# EAGLE design Buck300W_V3 (EAGLE 9.6.2)

## Sheet 1 of 2
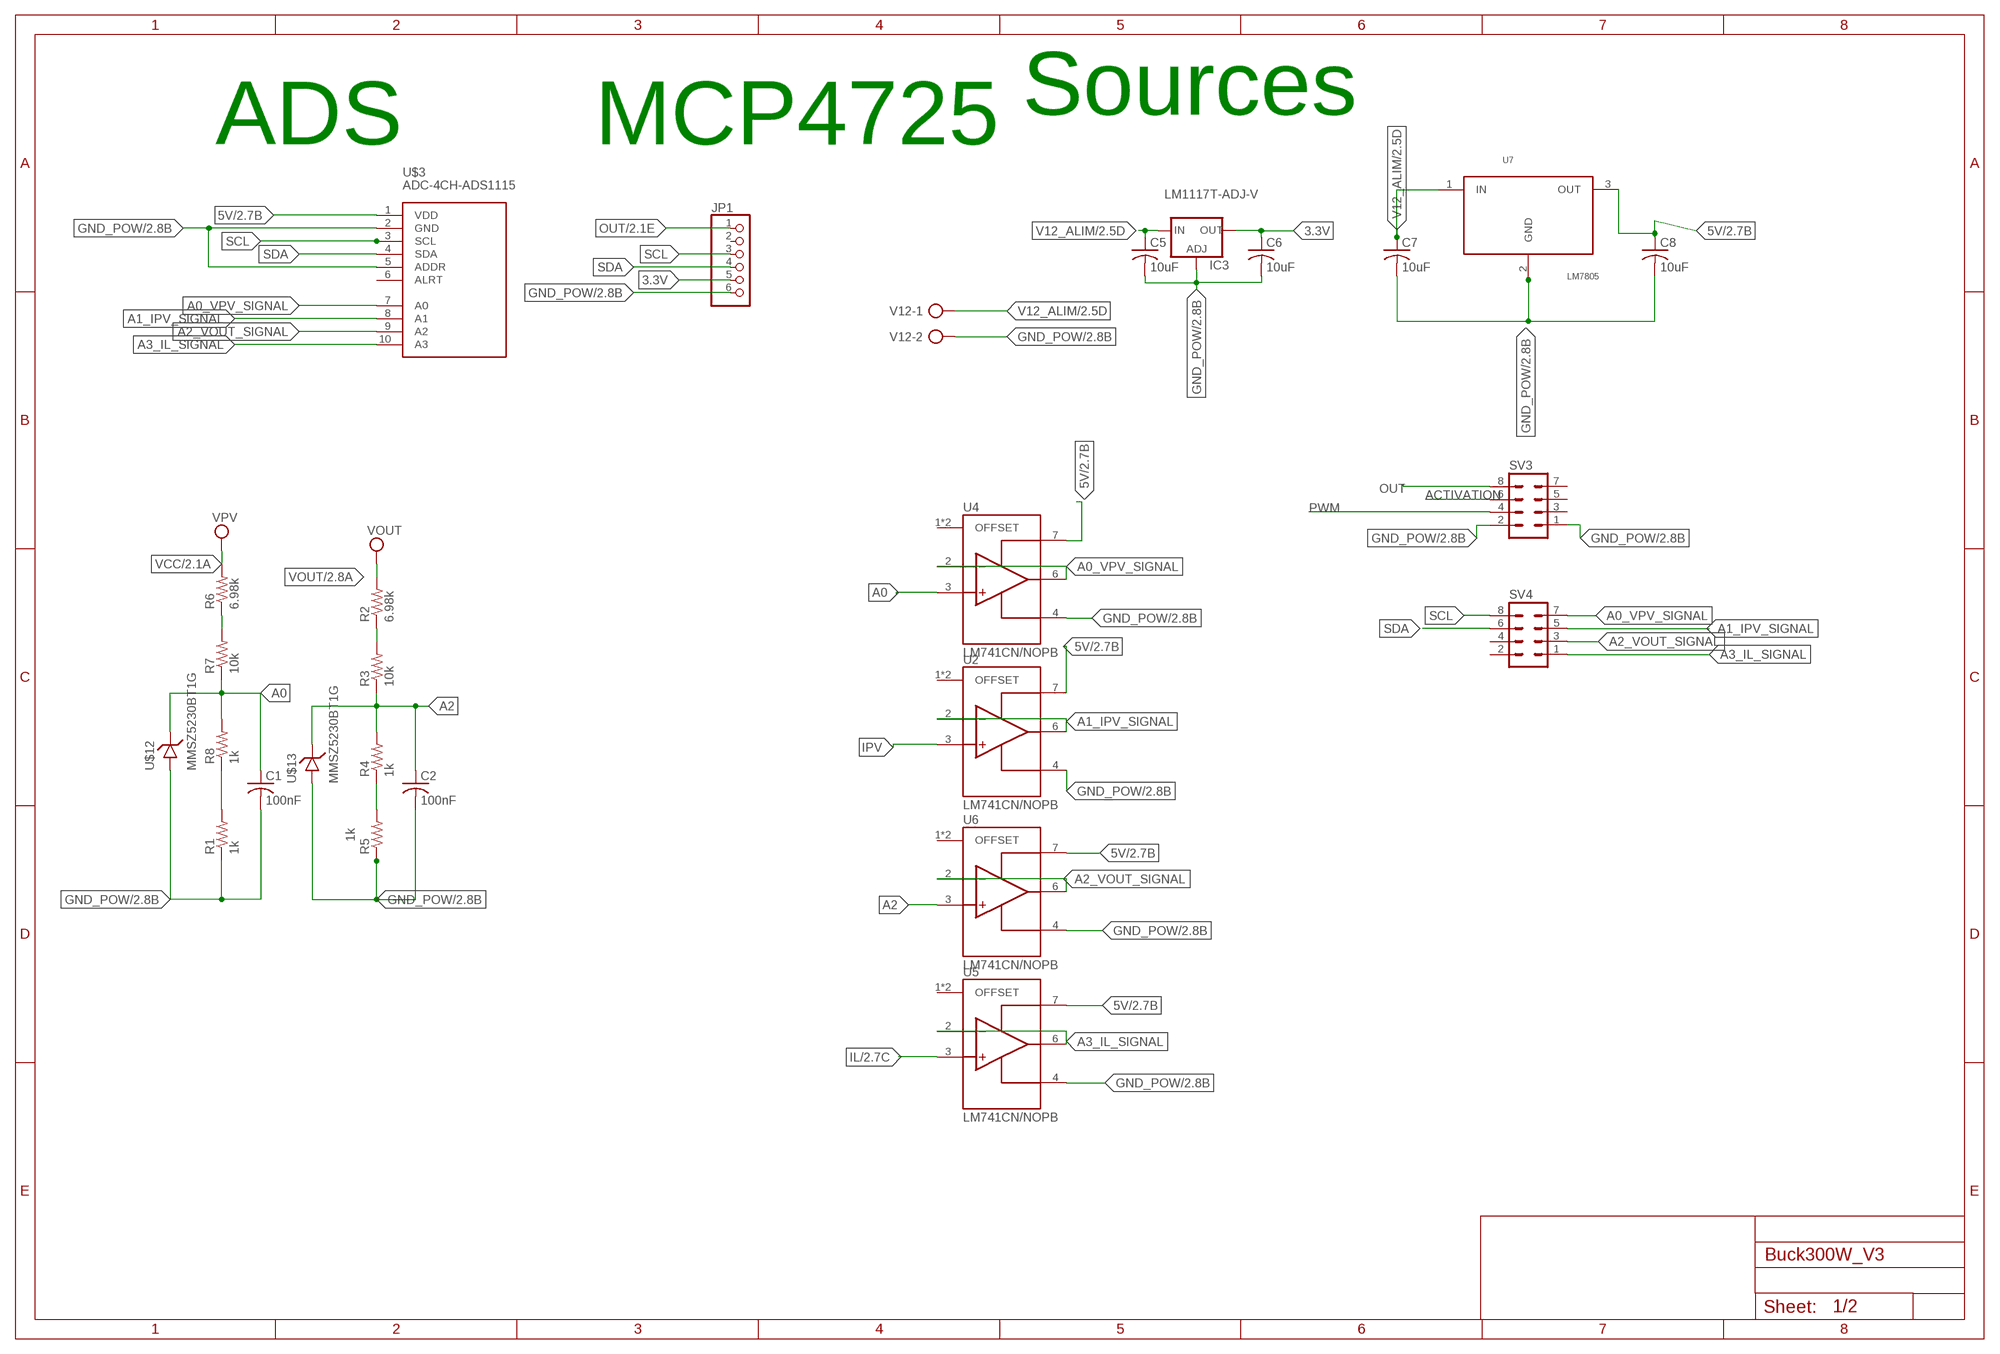
[diagram p0: schematic, sheet 1]

### Parts
C1  100nF  C-USC0805  [C0805]
C2  100nF  C-USC0805  [C0805]
C5  10uF  C-US025-024X044  [C025-024X044]
C6  10uF  C-US025-024X044  [C025-024X044]
C7  10uF  C-US025-024X044  [C025-024X044]
C8  10uF  C-US025-024X044  [C025-024X044]
IC3  LM1117T-ADJ-V  [TO220V]
JP1  MICROBUILDER_HEADER-1X6  [MICROBUILDER_1X06_OVAL]
R1  1k  R-US_R0805  [R0805]
R2  6.98k  R-US_R0805  [R0805]
R3  10k  R-US_R0805  [R0805]
R4  1k  R-US_R0805  [R0805]
R5  1k  R-US_R0805  [R0805]
R6  6.98k  R-US_R0805  [R0805]
R7  10k  R-US_R0805  [R0805]
R8  1k  R-US_R0805  [R0805]
SV3  MA04-2  [MA04-2]
SV4  MA04-2  [MA04-2]
U2  LM741CN/NOPB  [DIP794W45P254L1016H508Q8]
U4  LM741CN/NOPB  [DIP794W45P254L1016H508Q8]
U5  LM741CN/NOPB  [DIP794W45P254L1016H508Q8]
U6  LM741CN/NOPB  [DIP794W45P254L1016H508Q8]
U7  LM7805  [TO220]
U$3  ADC-4CH-ADS1115  [ADC-4CH-ADS1115]
U$12  MMSZ5230BT1G  [SOD3716X135N]
U$13  MMSZ5230BT1G  [SOD3716X135N]
V12  AK300/2  [AK300/2]

### Nets
3.3V: C6.1 IC3.2(OUT) JP1.5
5V: C8.1 U2.7(V+) U4.7(V+) U5.7(V+) U6.7(V+) U7.3(OUT) U$3.1(VDD) ; also sheet 2
A0: C1.1 R7.1 R8.2 U4.3(NON-INV_INPUT) U$12.2(ANODE)
A0_VPV_SIGNAL: SV4.7 U4.2(INV_INPUT) U4.6(OUTPUT) U$3.7(A0)
A1_IPV_SIGNAL: SV4.5 U2.2(INV_INPUT) U2.6(OUTPUT) U$3.8(A1)
A2: C2.1 R3.1 R4.2 U6.3(NON-INV_INPUT) U$13.2(ANODE)
A2_VOUT_SIGNAL: SV4.3 U6.2(INV_INPUT) U6.6(OUTPUT) U$3.9(A2)
A3_IL_SIGNAL: SV4.1 U5.2(INV_INPUT) U5.6(OUTPUT) U$3.10(A3)
ACTIVATION: SV3.6 ; also sheet 2
GND_POW: C1.2 C2.2 C5.2 C6.2 C7.2 C8.2 IC3.1(ADJ) JP1.6 R1.1 R5.1 SV3.1 SV3.2 U2.4(V-) U4.4(V-) U5.4(V-) U6.4(V-) U7.2(GND) U$3.2(GND) U$3.5(ADDR) U$12.1(CATHODE) U$13.1(CATHODE) V12.2 ; also sheet 2
IL: U5.3(NON-INV_INPUT) ; also sheet 2
IPV: U2.3(NON-INV_INPUT) ; also sheet 2
N$10: R6.1 R7.2
N$12: R2.1 R3.2
N$13: R1.2 R8.1
N$15: R4.1 R5.2
OUT: JP1.1 SV3.8 ; also sheet 2
PWM: SV3.4 ; also sheet 2
SCL: JP1.3 SV4.8 U$3.3(SCL)
SDA: JP1.4 SV4.6 U$3.4(SDA)
V12_ALIM: C5.1 C7.1 IC3.3(IN) U7.1(IN) V12.1 ; also sheet 2
VCC: R6.2 ; supply symbol labelled VPV ; also sheet 2
VOUT: R2.2 ; also sheet 2
Unconnected: JP1.2 SV3.3 SV3.5 SV3.7 SV4.2 SV4.4 U2.1(OFFSET) U2.5(OFFSET) U4.1(OFFSET) U4.5(OFFSET) U5.1(OFFSET) U5.5(OFFSET) U6.1(OFFSET) U6.5(OFFSET) U$3.6(ALRT)

### Notes on the sheet
- Sources
- ADS | MCP4725

## Sheet 2 of 2
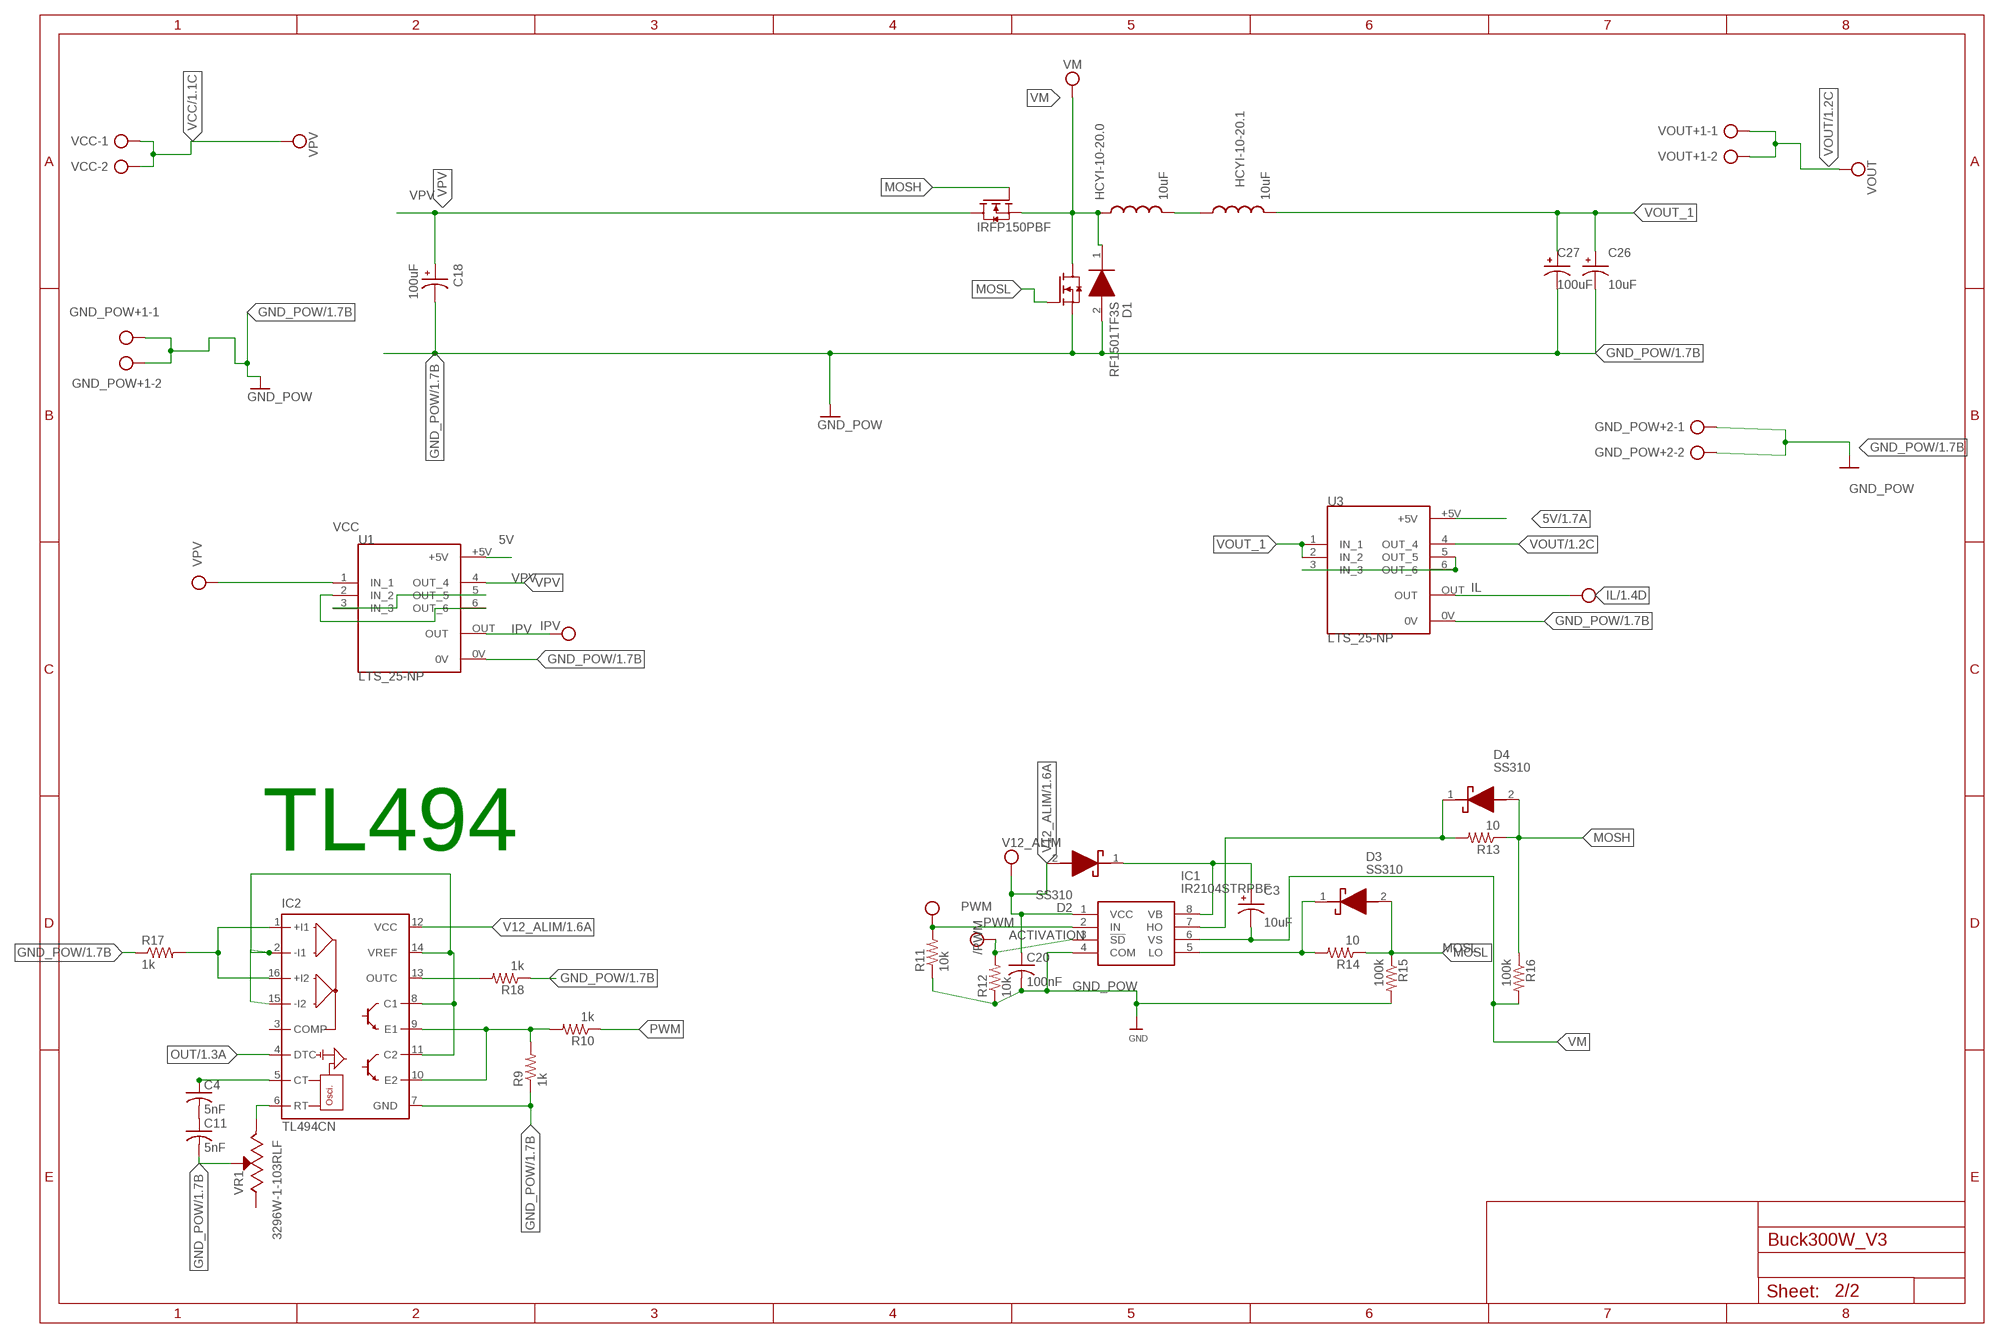
[diagram p1: schematic, sheet 2]

### Parts
C3  10uF  EEEFK1J101L  [CAP_EEEFK1J101L]
C4  5nF  C-US025-024X044  [C025-024X044]
C11  5nF  C-US025-024X044  [C025-024X044]
C18  100uF  EEEFK1J101L  [CAP_EEEFK1J101L]
C20  100nF  C-USC0805  [C0805]
C26  10uF  EEEFK1J101L  [CAP_EEEFK1J101L]
C27  100uF  EEEFK1J101L  [CAP_EEEFK1J101L]
D1  RF1501TF3S  [TO508P450X1010X1840-2P]
D2  SS310  [DIOM7959X262N]
D3  SS310  [DIOM7959X262N]
D4  SS310  [DIOM7959X262N]
GND_POW+1  AK300/2  [AK300/2]
GND_POW+2  AK300/2  [AK300/2]
HCYI-10-20.0  10uF  HCT1  [HCTI-10-20-0]
HCYI-10-20.1  10uF  HCT1  [HCTI-10-20-0]
IC1  IR2104STRPBF  [SOIC127P600X175-8N]
IC2  TL494CN  [DIL16]
R9  1k  R-US_0204/5  [0204/5]
R10  1k  R-US_0204/5  [0204/5]
R11  10k  R-US_R0805  [R0805]
R12  10k  R-US_R0805  [R0805]
R13  10  R-US_R0805  [R0805]
R14  10  R-US_R0805  [R0805]
R15  100k  R-US_R0805  [R0805]
R16  100k  R-US_R0805  [R0805]
R17  1k  R-US_0204/5  [0204/5]
R18  1k  R-US_0204/5  [0204/5]
U1  LTS_25-NP  [XDCR_LTS_25-NP]
U3  LTS_25-NP  [XDCR_LTS_25-NP]
U$1  IRFP150PBF  [TO545P1590X530X2460-3]
U$2  IRFP150PBF  [TO545P1590X530X2460-3]
VCC  AK300/2  [AK300/2]
VOUT+1  AK300/2  [AK300/2]
VR1  3296W-1-103RLF  [TRIM_3296W-1-103RLF]

### Nets
5V: U1.+5V U3.+5V ; also sheet 1
ACTIVATION: IC1.3(!SD) R12.2 ; supply symbol labelled /PWM ; also sheet 1
GND_POW: C11.2 C18.2 C20.2 C26.2 C27.2 D1.2(A) GND_POW+1.1 GND_POW+1.2 GND_POW+2.1 GND_POW+2.2 IC1.4(COM) IC2.7(GND) R9.1 R11.1 R12.1 R15.2 R17.1 R18.1 U1.0V U3.0V U$2.3(S) VR1.2(WIPER) ; supply symbol labelled GND ; also sheet 1
IL: U3.OUT ; also sheet 1
IPV: U1.OUT ; also sheet 1
MOSH: D4.2(A) R13.1 R16.1 U$1.1(G)
MOSL: D3.2(A) R14.1 R15.1 U$2.1(G)
N$1: C4.2 C11.1
N$2: IC2.9(E1) IC2.10(E2) R9.2 R10.2
N$3: C4.1 IC2.5(CT)
N$4: IC2.6(RT) VR1.3(CW)
N$5: U3.3(IN_3) U3.5(OUT_5) U3.6(OUT_6)
N$7: HCYI-10-20.0.2 HCYI-10-20.1.1
N$8: U1.2(IN_2) U1.6(OUT_6)
N$11: U1.3(IN_3) U1.5(OUT_5)
N$16: IC2.1(+I1) IC2.16(+I2) R17.2
N$17: C3.1 D2.1(K) IC1.8(VB)
N$18: IC2.13(OUTC) R18.2
N$19: D4.1(K) IC1.7(HO) R13.2
N$21: D3.1(K) IC1.5(LO) R14.2
N$22: IC2.2(-I1) IC2.8(C1) IC2.11(C2) IC2.14(VREF) IC2.15(-I2)
OUT: IC2.4(DTC) ; also sheet 1
PWM: IC1.2(IN) R10.1 R11.2 ; also sheet 1
V12_ALIM: C20.1 D2.2(A) IC1.1(VCC) IC2.12(VCC) ; also sheet 1
VCC: U1.1(IN_1) VCC.1 VCC.2 ; supply symbol labelled VPV ; also sheet 1
VM: C3.2 D1.1(K) HCYI-10-20.0.1 IC1.6(VS) R16.2 U$1.3(S) U$2.2(D)
VOUT: U3.4(OUT_4) VOUT+1.1 VOUT+1.2 ; also sheet 1
VOUT_1: C26.1 C27.1 HCYI-10-20.1.2 U3.1(IN_1) U3.2(IN_2)
VPV: C18.1 U1.4(OUT_4) U$1.2(D)
Unconnected: IC2.3(COMP) VR1.1(CCW)

### Notes on the sheet
- TL494

## Library data of the parts
C1 C2 C20 = rcl:C-US: CAPACITOR, American symbol; SPICEPREFIX: C
C3 C18 C26 C27 = EEEFK1J101L:EEEFK1J101L: Check prices <https://pricing.snapeda.com/parts/EEE-FK1J101L/Panasonic/view-part?ref=eda>; AVAILABILITY: In Stock; DESCRIPTION: Aluminum Electrolytic Capacitors, FK-V[HF] Series, 100uF +/- 20%, 63V, Surface mount type(10x10.2mm); MF: Panasonic; MP: EEE-FK1J101L; PACKAGE: RADIAL-2 Panasonic; PRICE: None; PURCHASE-URL: https://pricing.snapeda.com/search/part/EEE-FK1J101L/?ref=eda
C4-C8 C11 = adafruit:C-US: CAPACITOR, American symbol
D1 = RF1501TF3S:RF1501TF3S: Fast Recovery Diode Source: Datasheet <https://fscdn.rohm.com/en/products/databook/datasheet/discrete/diode/fast_recovery/rf1501tf3s.pdf>; DESCRIPTION: Fast Recovery Diode; HEIGHT: 4.5mm; MANUFACTURER_NAME: ROHM Semiconductor; MANUFACTURER_PART_NUMBER: RF1501TF3S; MOUSER_PART_NUMBER: 755-RF1501TF3S; MOUSER_PRICE-STOCK: https://www.mouser.com/Search/Refine.aspx?Keyword=755-RF1501TF3S
D2-D4 = SS310:SS310: TAIWAN SEMICONDUCTOR - SS310 - SCHOTTKY RECTIFIER, 3A, 100V, DO-214AB Source: Datasheet <https://componentsearchengine.com/Datasheets/1/SS310.pdf>; ARROW_PART_NUMBER: SS310; ARROW_PRICE-STOCK: https://www.arrow.com/en/products/ss310/taiwan-semiconductor?region=nac; DESCRIPTION: TAIWAN SEMICONDUCTOR - SS310 - SCHOTTKY RECTIFIER, 3A, 100V, DO-214AB; HEIGHT: 2.62mm; MANUFACTURER_NAME: Taiwan Semiconductor; MANUFACTURER_PART_NUMBER: SS310; MOUSER_PART_NUMBER: 821-SS310; MOUSER_PRICE-STOCK: https://www.mouser.co.uk/ProductDetail/Taiwan-Semiconductor/SS310?qs=tHU%2FlV7kTyQnmIwIRiOFBw%3D%3D
GND_POW+1 GND_POW+2 V12 VCC VOUT+1 = con-ptr500:AK300/2: CONNECTOR; OC_FARNELL: unknown; OC_NEWARK: unknown
HCYI-10-20.0 HCYI-10-20.1 = HCTI:HCT1
IC1 = IR2104STRPBF:IR2104STRPBF: MOSFET Driver, Dual, 8 Pin, Plastic, SOP Source: Datasheet <https://datasheet.lcsc.com/szlcsc/International-Rectifier-IR-IR2104STRPBF_C2960.pdf>; ARROW_PART_NUMBER: IR2104STRPBF; ARROW_PRICE-STOCK: https://www.arrow.com/en/products/ir2104strpbf/infineon-technologies-ag?region=nac; DESCRIPTION: MOSFET Driver, Dual, 8 Pin, Plastic, SOP; HEIGHT: 1.75mm; MANUFACTURER_NAME: Infineon; MANUFACTURER_PART_NUMBER: IR2104STRPBF; MOUSER_PART_NUMBER: 942-IR2104STRPBF; MOUSER_PRICE-STOCK: https://www.mouser.co.uk/ProductDetail/Infineon-IR/IR2104STRPBF?qs=2r01AXMCG3NCbspWVHqTYw%3D%3D
IC2 = linear:TL494*: SWITCHMODE Pulse Width Modulation Control Circuit NCV494B http://onsemi.com tl494-d.pdf
IC3 = lm1117:LM1117T-ADJ
JP1 = Adafruit MCP4725 Original:MICROBUILDER_HEADER-1X6: PIN HEADER
R1-R8 = rcl:R-US_: RESISTOR, American symbol; SPICEPREFIX: R
R9-R18 = adafruit:R-US_: RESISTOR, American symbol
SV3 SV4 = con-lstb:MA04-2: PIN HEADER; OC_FARNELL: unknown; OC_NEWARK: unknown
U1 U3 = LTS_25-NP:LTS_25-NP: Sensor Current Hall 25a Ac/Dc; AVAILABILITY: Unavailable; DESCRIPTION: Sensor Current Hall 25a Ac/Dc; MF: LEM USA; MP: LTS 25-NP; PACKAGE: Ring-6 LEM; PRICE: None
U2 U4-U6 = LM741CN_NOPB:LM741CN/NOPB: Check availability <https://pricing.snapeda.com/parts/LM741CN/Texas/view-part?ref=eda>; AVAILABILITY: In Stock; DESCRIPTION: Operational Amplifiers - Op Amps Operational Amplifier 8-PDIP 0 to 70; MF: Texas; MP: LM741CN; PACKAGE: DIP-8 Texas; PRICE: None; PURCHASE-URL: https://pricing.snapeda.com/search/part/LM741CN/?ref=eda
U7 = LM7805:LM7805: Check availability <https://pricing.snapeda.com/parts/LM7805/Texas%20Instruments/view-part?ref=eda>; AVAILABILITY: In Stock; DESCRIPTION: Linear Voltage Regulator IC Positive Fixed 1 Output 1.5A DDPAK/TO-263-3; MF: Texas Instruments; MP: LM7805; PACKAGE: None; PRICE: None; PURCHASE-URL: https://pricing.snapeda.com/search/part/LM7805/?ref=eda
U$1 U$2 = IRFP150PBF:IRFP150PBF
U$3 = diy-modules:ADC-4CH-ADS1115: 4 Channel 16-Bit Analog-to-Digital Converter based on ADS1115 chip Arduino ADS1115 Getting Started Tutorial is available here: http://henrysbench.capnfatz.com/henrys-bench/arduino-voltage-measurements/arduino-ads1115-module-getting-started-tutorial/ ADS1115 datasheet is available here: http://www.ti.com/lit/ds/symlink/ads1115.pdf Click here to find device on ebay.com <http://www.ebay.com/sch/ads1115+module>
U$12 U$13 = Diode Zener:MMSZ5230BT1G
VR1 = 3296W-1-103RLF:3296W-1-103RLF: Res Cermet Trimmer 500K Ohm 10% 0.5W 25(Elec)Turn 2.19mm (9.53 X 4.83 X 11.55mm) Pin Thru-Hole Tube Check availability <https://pricing.snapeda.com/parts/3296W-1-103RLF/Bourns/view-part?ref=eda>; AVAILABILITY: In Stock; DESCRIPTION: 10 kOhms 0.5W, 1/2W PC Pins Through Hole Trimmer Potentiometer Cermet 25.0 Turn Top Adjustment; MF: Bourns; MP: 3296W-1-103RLF; PACKAGE: SOT-23-5 Bourns; PRICE: None; PURCHASE-URL: https://pricing.snapeda.com/search/part/3296W-1-103RLF/?ref=eda

## Board
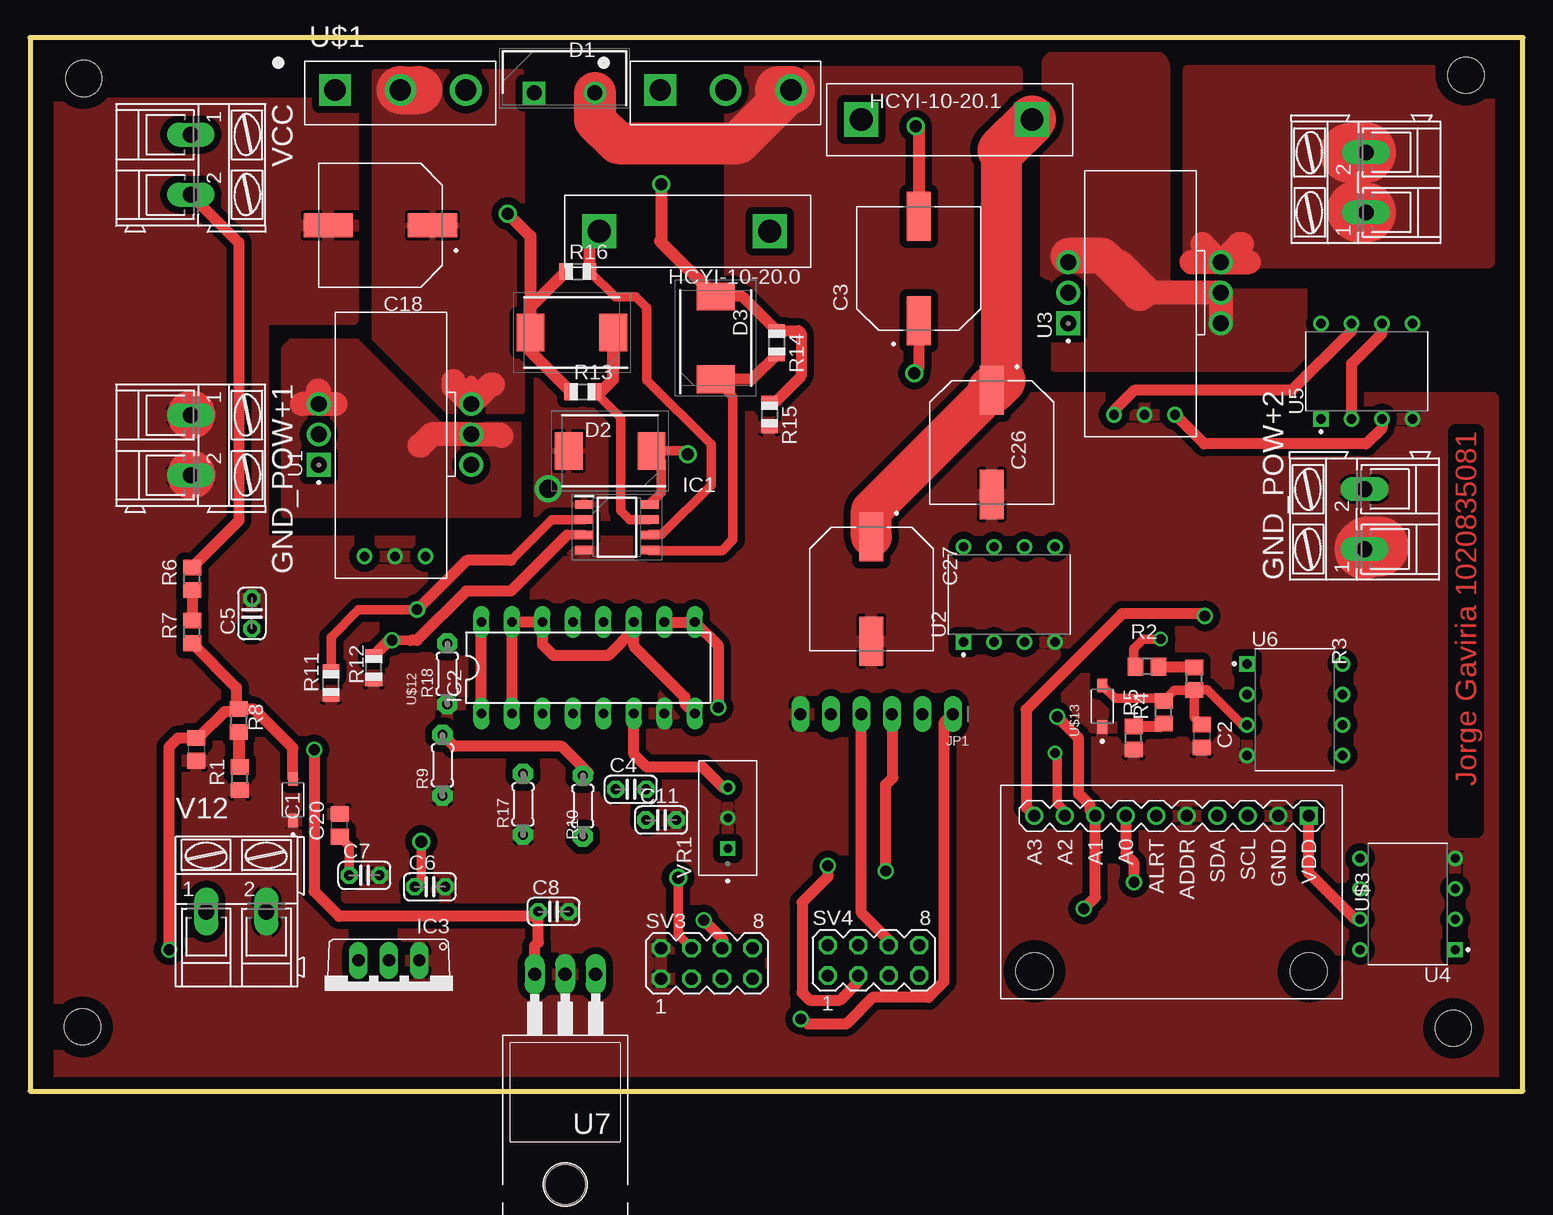
[diagram p2: board, top side]
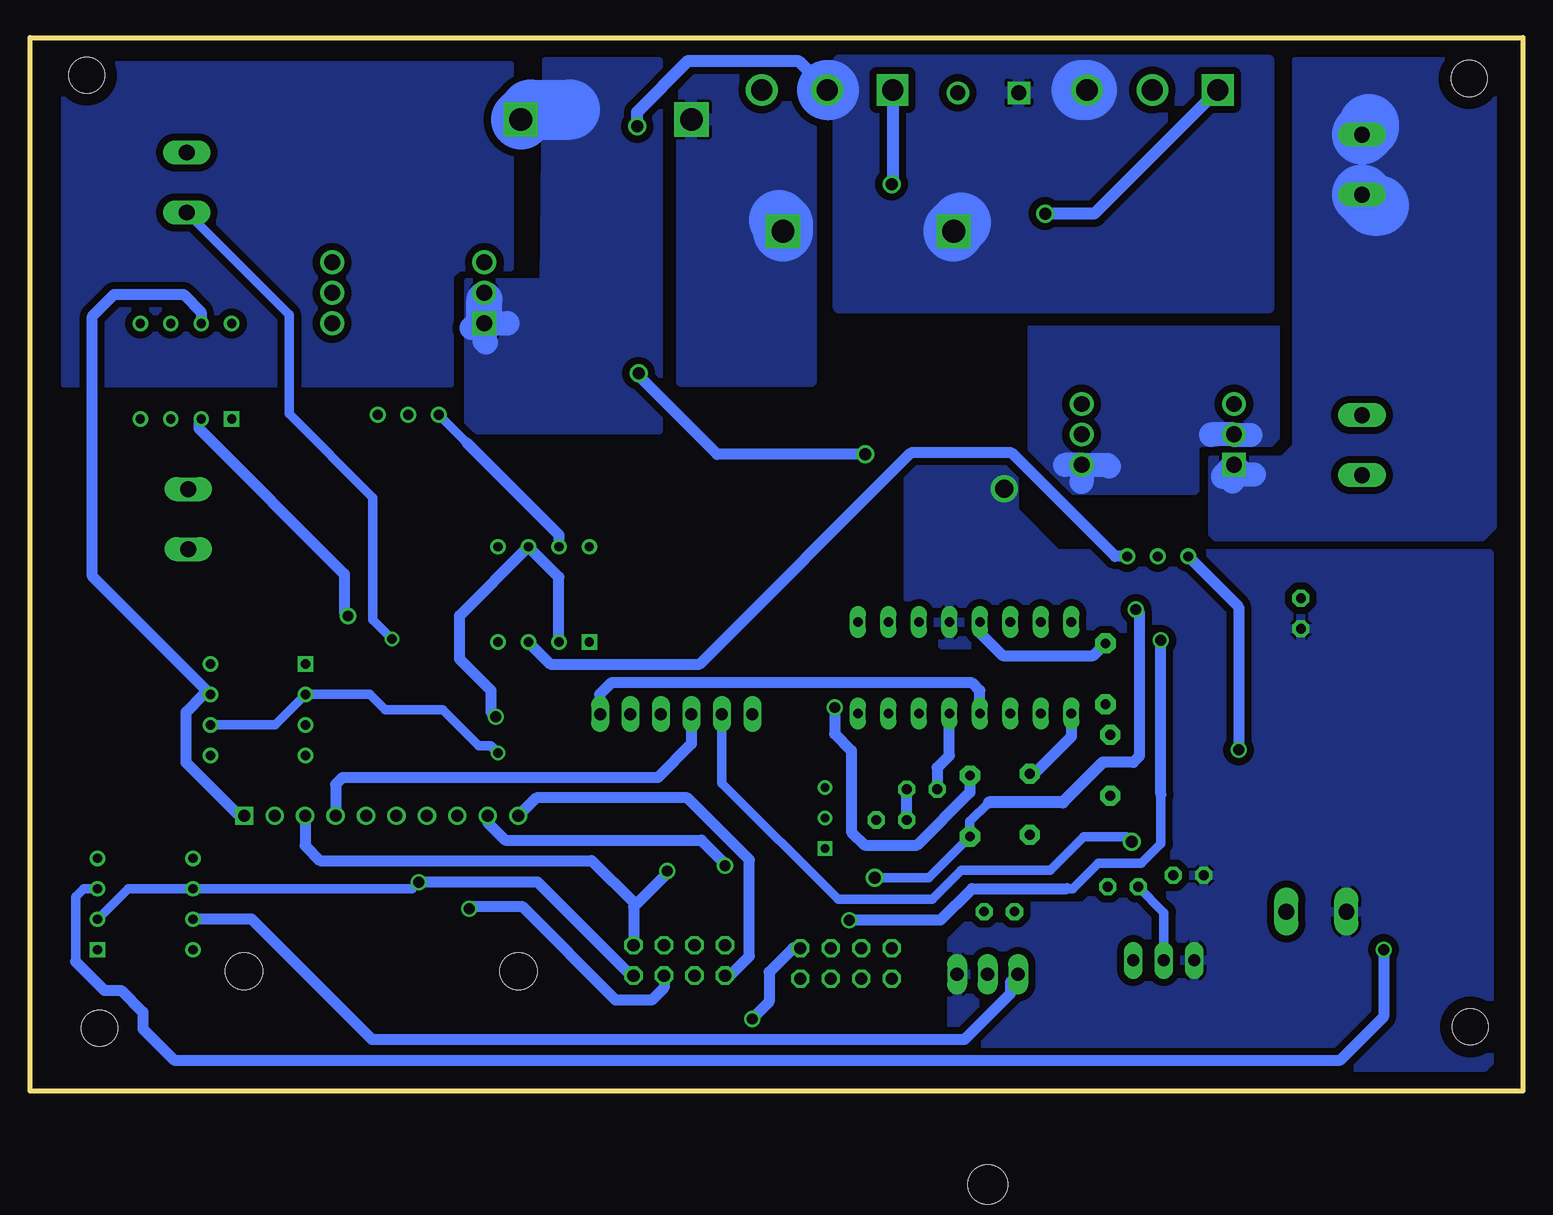
[diagram p3: board, bottom side, seen from below]

Size 124.4 x 87.8 mm. Coordinates in mm from the lower left corner, seen from the top.
Outline: 0,87.8 0,0 124.4,0 124.4,87.8 0,87.8
Copper layers (1*16): Top 0.035mm / dielectric 0.15mm / Bottom 0.035mm
Design rules "default *": minimum track width 6mil, minimum drill 0.35mm, track to track 0.6mm, track to pad 0.6mm, pad to pad 0.6mm, via to via 0.6mm, smd to smd 6mil, copper to edge 40mil, drill to drill 6mil, minimum pad ring 10mil, minimum via ring 8mil, stop-mask expansion 4mil, vias tented up to drill 0mil, thermal gap 10mil
Holes 3 mm at 4.37,5.36 118.61,5.24 4.47,84.4 119.67,84.66

### Footprints (pad centres in the part's own frame; a part is rotated, then mirrored left to right if it is on the bottom)
C0805 = smd 1.3 x 1.5: 1 -0.95,0; 2 0.95,0
CAP_EEEFK1J101L = smd 4.1 x 2: 1 -4.35,0; 2 4.35,0
C025-024X044 = drill 0.813 pad 1.422 octagon: 1 -1.27,0; 2 1.27,0
TO508P450X1010X1840-2P = drill 1.25 pad 1.875 square: 1 0,0 | drill 1.25 pad 1.875: 2 5.08,0
DIOM7959X262N = smd 2.3 x 3.15: 1 -3.45,0; 2 3.45,0
AK300/2 = drill 1.321 long: 1 -2.515,0; 2 2.489,0
HCTI-10-20-0 = drill 1.9 square: 1 -7.112,0; 2 7.112,0
SOIC127P600X175-8N = smd 1.525 x 0.7: 1 -2.712,1.905; 2 -2.712,0.635; 3 -2.712,-0.635; 4 -2.712,-1.905; 5 2.712,-1.905; 6 2.712,-0.635; 7 2.712,0.635; 8 2.712,1.905
DIL16 = drill 0.813 long: 1 -8.89,-3.81; 2 -6.35,-3.81; 3 -3.81,-3.81; 4 -1.27,-3.81; 5 1.27,-3.81; 6 3.81,-3.81; 7 6.35,-3.81; 8 8.89,-3.81; 9 8.89,3.81; 10 6.35,3.81; 11 3.81,3.81; 12 1.27,3.81; 13 -1.27,3.81; 14 -3.81,3.81; 15 -6.35,3.81; 16 -8.89,3.81
TO220V = drill 1.016 long: 1 -2.54,-2.54; 2 0,-2.54; 3 2.54,-2.54
MICROBUILDER_1X06_OVAL = drill 1 long: 1 -6.35,0; 2 -3.81,0; 3 -1.27,0; 4 1.27,0; 5 3.81,0; 6 6.35,0
R0805 = smd 1.3 x 1.5: 1 -0.95,0; 2 0.95,0
0204/5 = drill 0.813 pad 1.676 octagon: 1 -2.54,0; 2 2.54,0
R0805' = smd 1.1 x 1.4: 1 -1,0; 2 1,0
MA04-2 = drill 1.016 octagon: 1 -3.81,-1.27; 2 -3.81,1.27; 3 -1.27,-1.27; 4 -1.27,1.27; 5 1.27,-1.27; 6 1.27,1.27; 7 3.81,-1.27; 8 3.81,1.27
XDCR_LTS_25-NP = drill 0.81: 0V -9.26,0; +5V -9.26,2.54; OUT -9.26,-2.54 | drill 1.33 square: 1 -1.64,6.35 | drill 1.33: 2 0.9,6.35; 3 3.44,6.35; 4 3.44,-6.35; 5 0.9,-6.35; 6 -1.64,-6.35
DIP794W45P254L1016H508Q8 = drill 0.78 pad 1.13 square: 1 -3.97,3.81 | drill 0.78 pad 1.13: 2 -3.97,1.27; 3 -3.97,-1.27; 4 -3.97,-3.81; 5 3.97,-3.81; 6 3.97,-1.27; 7 3.97,1.27; 8 3.97,3.81
TO220 = drill 1.118 long: 1 -2.54,-6.35; 2 0,-6.35; 3 2.54,-6.35 | hole 3.302: 0,11.176
TO545P1590X530X2460-3 = drill 1.76 pad 2.64 square: 1 -5.45,0.25 | drill 1.76 pad 2.64: 2 0,0.25; 3 5.45,0.25
ADC-4CH-ADS1115 = drill 1 square: 1 -6.35,11.43 | drill 1: 2 -6.35,8.89; 3 -6.35,6.35; 4 -6.35,3.81; 5 -6.35,1.27; 6 -6.35,-1.27; 7 -6.35,-3.81; 8 -6.35,-6.35; 9 -6.35,-8.89; 10 -6.35,-11.43 | hole 3.1: 6.604,11.43; 6.604,-11.43
SOD3716X135N = smd 1.12 x 0.8: 1 -1.73,0; 2 1.73,0
TRIM_3296W-1-103RLF = drill 0.71 square: 1 -2.54,0 | drill 0.71: 2 0,0; 3 2.54,0

### Placement (x,y rotation side)
C1  13.85,28.49 270 top
C2  97.64,29.6 270 top
C3  74.06,68.56 90 top
C4  50.07,25.16 0 top
C5  18.49,39.81 90 top
C6  33.33,17.03 0 top
C7  27.86,17.99 0 top
C8  43.63,14.97 0 top
C11  52.6,22.6 0 top
C18  29.19,72.16 180 top
C20  25.79,22.16 90 top
C26  80.14,54.07 270 top
C27  70.11,41.86 270 top
D1  42,83.2 0 top
D2  48.34,53.36 180 top
D3  57.14,62.78 90 top
D4  45.15,63.23 180 top
GND_POW+1  13.4,53.83 270 top
GND_POW+2  111.21,47.68 90 top
HCYI-10-20.0  54.54,71.66 0 top
HCYI-10-20.1  76.39,80.97 0 top
IC1  48.91,46.99 0 top
IC2  46.51,35.29 0 top
IC3  29.91,8.36 180 top
JP1  70.55,31.42 180 top
R1  17.48,26.06 90 top
R2  93.09,35.39 180 top
R3  97.02,34.37 90 top
R4  94.46,31.58 90 top
R5  91.96,29.44 90 top
R6  13.51,42.71 90 top
R7  13.51,38.28 90 top
R8  17.41,30.89 90 top
R9  34.37,27.16 90 top
R10  46.07,23.76 90 top
R11  10k  [R0805']  25.08,34.02 90 top
R12  10k  [R0805']  28.64,35.29 90 top
R13  10  [R0805']  46.06,58.29 0 top
R14  10  [R0805']  62.22,62.38 270 top
R15  100k  [R0805']  61.62,56.39 270 top
R16  100k  [R0805']  45.66,68.31 0 top
R17  41.09,23.91 90 top
R18  34.77,34.78 90 top
SV3  56.4,10.65 0 top
SV4  70.3,10.9 0 top
U1  30.42,53.83 90 top
U2  81.6,41.4 90 top
U3  92.88,65.62 90 top
U4  114.8,15.6 180 top
U5  111.4,60 90 top
U6  105.4,31.8 0 top
U7  44.6,3.4 180 top
U$1  30.87,83.18 0 top
U$2  57.96,83.18 0 top
U$3  95.13,16.6 270 top
U$12  21.91,24.29 90 top
U$13  89.35,32.07 90 top
V12  17.21,14.97 0 top
VCC  13.4,77.2 270 top
VOUT+1  111.33,75.74 90 top
VR1  58.15,22.77 90 top

### Tracks (layer width: path | path; a pad name or v marks a point on that pad's centre or on a via)
3.3V  (via drill 1)
  Top 0.8: C6.1 32.6,17.58 v32.6,20.8
  Bottom 0.8: IC3.2 29.91,14.89 C6.1 | v32.6,20.8 33,21.2 36.6,21.2 39.4,18.4 46.8,18.4 49.2,16 57.06,16 66.74,25.67 JP1.5
5V  (via drill 0.9)
  Top 0.9: v23.68,28.45 23.68,16.65 25.76,14.57 41.96,14.57 C8.1 42.36,12.4 42.06,12.1 U7.3 | U4.7 110.43,14.33 106.56,18.2 U$3.1 | U5.7 110.13,63.37 105.16,58.4 92,58.4 90.34,56.74 U3.+5V
  Bottom 0.8: U3.+5V 88,54.02
  Bottom 0.9: C8.1 | U1.+5V 23.68,40.37 v23.68,28.45 | U4.7 105.93,14.33 95.9,4.3 46.54,4.3 42.71,8.13 42.71,9.1 U7.3 | U$3.1 106.96,22.95 111.4,27.39 111.4,31.6 109.93,33.07 U6.7 119.2,42.9 119.2,64.6 117.4,66.4 111.6,66.4 110.13,64.93 U5.7 | 88,54.02 80.33,46.35 U2.7
A0  (via drill 0.9)
  Top 0.4: R8.2 17.2,31.84
  Top 0.9: R7.1 17.2,33.64 17.2,31.84 18.67,31.84 21.91,28.6 U$12.2 | v11.6,11.8 11.6,28.69 12.35,29.44 C1.1 14.03,29.44 16.23,31.64 17.21,31.64 R8.2
  Bottom 0.8: 120.6,10.8 120.6,16.2 119.93,16.87 U4.3
  Bottom 0.9: v11.6,11.8 11.6,6.2 15.2,2.6 112.4,2.6 115,5.2 115,6.6 116.8,8.4 118.2,8.4 120.6,10.8
A0_VPV_SIGNAL  (via drill 0.9)
  Top 0.9: v92,17.42 92,19.02 91.32,19.7 U$3.7
  Bottom 0.8: v92,17.42 92.55,16.87 U4.6 116.23,16.87 U4.2
  Bottom 0.9: SV4.7 74.31,9.63 82.09,17.42 v92,17.42
A1_IPV_SIGNAL  (via drill 0.9)
  Top 0.9: v85.6,31.2 87.38,29.41 87.38,24.78 88.34,23.82 88.34,23.39 U$3.8 88.78,16.18 v87.8,15.2
  Bottom 0.9: SV4.5 71.57,8.63 72.6,7.6 75.6,7.6 83.4,15.4 87.6,15.4 v87.8,15.2 | U2.2 80.33,42.83 U2.6 88.6,39.64 88.6,36 86,33.4 86,31.6 v85.6,31.2
A2
  Top 0.8: U$13.2 90.42,32.73 94.26,32.73 R4.2 95.36,33.42 R3.1 | C2.1 97.02,31.17 R3.1 | R3.1 97.07,33.47 98.09,33.47 101.03,30.53 U6.3
A2_VOUT_SIGNAL  (via drill 0.8, 0.9)
  Top 0.8: U$3.9 86.24,23.35 85.6,23.99 85.6,28 v85.4,28.2
  Top 0.9: v66.49,18.78 66.49,17.88 64.35,15.74 64.35,8.22 64.96,7.6 67.5,7.6 69.03,9.12 SV4.3
  Bottom 0.8: v85.4,28.2 86,28.8 87,28.8 90,31.8 94.8,31.8 96.07,33.07 U6.2 103.97,30.53 U6.6
  Bottom 0.9: U$3.9 86.24,22.35 84.81,20.92 68.45,20.92 66.67,19.14 66.67,18.96 v66.49,18.78
A3_IL_SIGNAL  (via drill 0.9)
  Top 0.9: U5.2 110.13,60.63 112.67,63.17 U5.6 | v97.9,39.6 97.7,39.8 91,39.8 83,31.8 83,23.65 U$3.10
  Bottom 0.9: SV4.1 66.09,9.63 64.45,11.26 64.45,19.28 69.62,24.45 82.2,24.45 U$3.10 | U5.2 110.13,55.83 110.33,55.63 110.33,55.23 98.2,43.1 98.2,39.9 v97.9,39.6
ACTIVATION  (via drill 0.9)
  Top 0.8: 31.71,37.57 v30.16,37.57 30.15,37.56 | 44.76,46.36 IC1.3
  Top 0.9: SV3.6 57.74,11.99 57.74,12.65 v56.14,14.25 | 31.71,37.57 32.24,37.57 36.34,41.67 40.07,41.67 44.76,46.36
  Top 1: R12.2 29.91,37.56 30.15,37.56
  Bottom 0.8: 38,16.89 37.51,16.89 35.4,19 31.8,19 30.16,20.64 30.16,24.73
  Bottom 0.9: 30.16,24.73 v30.16,37.57 | v56.14,14.25 48.54,14.25 45.9,16.89 38,16.89
GND_POW
  Top 3.5: D1.2 47.08,80.92 49,79 58.98,79 U$2.3
  Top 4: U$2.3 62.43,83.43 | GND_POW+1.1 13.46,56.4 | GND_POW+1.2 13.46,51.4
  Top 5: GND_POW+2.1 111.44,45.4 112.4,45.4
  pour Top: 26.91,82.34 26.91,64.33 19.4,64.33 19.4,45.84 58.34,45.84 58.34,84.94 82.23,84.94 82.23,57.77 121.89,57.77 121.89,0.45 2.48,0.45 2.48,82.34
IL
  Top 0.9: U5.3 112.67,55.26 111.35,53.94 97.85,53.94 U3.OUT
IPV
  Bottom 0.9: U1.OUT 33.97,44.57 42.6,53.2 51,53.2 68.6,35.6 81.04,35.6 U2.3
MOSH  (via drill 1)
  Top 1: v39.82,73.13 41.7,71.25 D4.2 | R16.1 41.7,65.35 D4.2 | D4.2 41.7,61.65 R13.1
  Bottom 1: U$1.1 35.72,73.13 v39.82,73.13
MOSL  (via drill 1)
  Top 0.9: D3.2 59.37,66.23 R14.1 64.05,63.38 64.26,63.16 64.26,59.6 62.05,57.38 R15.1
  Top 1: D3.2 52.51,70.85 52.6,70.94 v52.6,75.6
  Bottom 1: U$2.1 52.51,75.89 52.6,75.8 v52.6,75.6
N$1
  Bottom 0.9: C11.1 C4.2
N$2  (via drill 0.9)
  Top 0.9: R10.2 46.21,26.27 46.52,26.53 44.32,28.74 35.34,28.74 R9.2 | IC2.10 IC2.9 57.34,37.16 v57.34,31.98
  Bottom 0.9: v57.34,31.98 57.34,29.78 55.94,28.38 55.94,21.58 54.86,20.5 50.47,20.5 46.07,24.9 R10.2
N$3
  Bottom 0.9: IC2.5 47.78,27.97 48.8,26.96 C4.1
N$4
  Top 0.9: VR1.3 57.75,25.31 56.06,27 51.4,27 50.32,28.08 IC2.6
N$5
  Top 2: 86.53,69.12 90.88,69.12 93.48,66.52 | U3.6 U3.5 92.48,66.52
  Top 3: 86.53,69.62 89.38,69.62 92.48,66.52
  pour Top: 121.3,65.4 121.3,61.4 85.7,61.4 85.7,85.3 93.5,85.3 93.5,67.1 95.2,65.4
N$7
  Bottom 5: HCYI-10-20.0.2 61.65,72.25 62,72.6
  pour Bottom: 59.3,59.2 59.3,85.6 70.1,85.6 70.1,59.2
N$8
  Bottom 2: U1.6 34.62,52.19 34.48,52.05 | U1.6 36.77,50.78 | U1.6 38.15,52.19 | 26,54.7 25.97,54.73 U1.2 24.04,54.7 22.7,54.7
  pour Bottom: 20.9,53.8 20.3,54.4 20.3,63.7 41.2,63.7 41.2,49.8 27.2,49.8 27,50 27,53.6 26.8,53.8
N$9
  pour Bottom: 121.6,85.6 121.6,58.9 89.3,58.9 89.3,67.9 88.6,68.6 84.3,68.6 84.3,85.6
N$10
  Top 0.9: R6.1 R7.2
N$11
  Top 2: U1.3 25.45,57.27 | U1.3 22.68,57.27 | 32.45,53.83 32.57,53.83 33.47,54.73 U1.5 39.17,54.73 39.31,54.59 | U1.3 24.07,58.33 24,58.4
  pour Top: 21.2,48 21.2,61.9 21.8,62.5 27.2,62.5 34.1,55.6 40.7,55.6 40.7,48
N$12
  Top 0.8: 94.1,35.32 R2.1
  Top 0.9: R3.2 94.1,35.32
N$13
  Top 1: R8.1 17.41,26.94 R1.2
N$15
  Top 0.9: R4.1 94.22,30.39 R5.2
  Top 1: R5.2 92.2,30.63
N$16
  Top 0.9: IC2.1 IC2.16
  Bottom 0.9: IC2.1 37.62,29.55 40.72,26.45 R17.2
N$17  (via drill 1)
  Top 0.8: IC1.8 52.59,49.87 52.59,52.56 D2.1 54.51,53.36 v54.8,53.07
  Top 0.9: v73.69,59.83 74.06,60.2 C3.1
  Bottom 0.9: v54.8,53.07 67.15,53.07 73.69,59.6 v73.69,59.83
N$18
  Bottom 0.9: IC2.13 45.24,38.19 43.36,36.3 35.79,36.3 R18.2
N$19
  Top 0.8: R13.2 49.21,56.14 49.21,48.39 49.97,47.63 IC1.7
  Top 1: R13.2 47.57,58.29 48.6,59.33 D4.1
N$21
  Top 0.8: D3.1 58.58,57.88 58.58,45.94 57.68,45.04 51.66,45.04 IC1.5
  Top 0.9: R14.2 60.17,59.33 D3.1
N$22
  Top 0.9: IC2.2 IC2.15 IC2.14 42.7,37.23 43.63,36.3 48.18,36.3 50.32,38.44 IC2.11 50.32,37.09 54.57,32.84 54.57,32.31 IC2.8
OUT  (via drill 0.9)
  Top 0.9: JP1.1 76.16,30.69 76.16,9.13 74.86,7.82 70.22,7.82 68,5.6 64.84,5.6 64.42,6.02 v64.22,6.02
  Bottom 0.9: IC2.4 45.24,33.38 45.89,34.03 75.97,34.03 76.94,33.06 76.94,31.46 JP1.1 | v64.22,6.02 62.81,7.44 62.81,9.92 60.81,11.92 SV3.8
PWM  (via drill 0.9, 1)
  Top 0.8: IC1.2 43.47,47.63 40.09,44.24 | 32.27,40.11 27.37,40.11 25.08,37.83 R11.2 | SV3.4 54,13.04 v54,17.8
  Top 0.9: v32.25,40.14 32.27,40.11 36.4,44.24 40.09,44.24
  Bottom 0.8: 44.48,24.07 46.07,22.48 R10.1 49.49,17.8 v54,17.8
  Bottom 0.9: 34.99,27.41 32.45,27.41 31.94,27.92 31.94,39.83 v32.25,40.14
  Bottom 1: 34.99,27.41 38.33,24.07 44.48,24.07
SCL  (via drill 0.9)
  Top 0.9: v71.3,18.35 71.3,25.54 71.9,26.14 71.9,31.34 JP1.3
  Bottom 0.9: 74.11,15.37 71.3,18.17 v71.3,18.35 | 74.11,15.37 74.11,15.73 77.6,19.22 100.24,19.22 101.48,20.46 U$3.3 | 74.11,15.37 SV4.8
SDA
  Top 0.9: SV4.6 71.57,12.57 69.28,14.86 JP1.4
  Bottom 0.9: JP1.4 69.28,28.94 72.08,26.14 98.36,26.14 98.94,25.56 U$3.4
V12_ALIM  (via drill 1.5)
  Top 0.8: C7.1 26.59,20.41 C20.1
  other vias: 43.2,50.2
  pour Top: 42.2,59.8 42.2,47.8 53.4,47.8 53.4,59.8
  pour Bottom: 47.6,3.8 47.6,12.6 44.8,15.4 36.6,15.4 34.4,17.6 31.2,17.6 29,19.8 29,36 30.2,37.2 48.4,37.2 51.2,40 51.2,58 49.8,59.4 42.6,59.4 42.4,59.2 42.4,48.4 38.8,44.8 2.8,44.8 2.8,2.4 3.2,2 45.8,2
VCC
  Top 0.9: VCC.2 17.4,70.71 17.4,47.55 R6.2
  Bottom 2: U1.1 24.2,52.06 24.2,50.8 | U1.1 23.28,51.4 22.4,51.4 | U1.1 25,51.26 25,51.2
  Bottom 5: VCC.2 12.49,73.8 12,73.8 | VCC.1 12.8,80.31 12.8,80.6
  pour Bottom: 2.4,85.8 2.4,47 3.4,46 25.6,46 26,46.4 26,52.8 20,52.8 19,53.8 19,86 2.6,86
VM  (via drill 1)
  Top 0.8: R16.2 48.76,66.2 50.48,66.2 51.4,65.28 51.4,59.26 56.75,53.91 56.75,50.52 52.66,46.43 51.69,46.43 IC1.6
  Top 1: HCYI-10-20.0.1 46.66,70.89 R16.2 | v73.8,80.4 74.06,80.4 C3.2
  Bottom 1: v73.8,80.4 73.8,81.6 69.55,85.85 60.38,85.85 U$2.2
  Bottom 5: HCYI-10-20.0.1 47.43,71.77 46.8,72.4 | U$2.2 57.83,83.43 | U$1.3 36.77,83.43
  pour Bottom: 21.2,85.9 21.2,65.3 57,65.3 57,85.9
VOUT  (via drill 0.8)
  Top 0.8: R2.2 91.99,35.54 91.99,36.87 92.79,37.67 v94.23,37.67
  Top 2: U3.4 100.77,70.6 101,70.6 | U3.4 97.7,70.59 97.7,70.6 | U3.4 99.27,69.1 101.6,69.1 | U3.4 96.84,69.06 96.8,69.1
  Top 5: VOUT+1.2 111.3,78.2 110,78.2 | VOUT+1.1 110.77,73.23 110.6,73.4
  Bottom 0.8: v94.23,37.67 95.83,39.27 95.83,49.47 102.8,56.45 102.8,64.69 VOUT+1.1
  pour Top: 96.5,85 96.5,69.1 121.6,69.1 121.6,85
VOUT_1
  Top 3.4: C26.1 70.11,48.39 C27.1 | 80.94,78.41 80.94,59.22
  Top 4: HCYI-10-20.1.2 80.94,78.41 | 80.94,59.22 C26.1
  Bottom 2: U3.1 84.62,63.98 84.6,64 | U3.1 86.53,62.53 86.4,62.4 | U3.1 87.22,63.98 87.6,63.6
  Bottom 3: U3.1 86.53,65.97
  Bottom 5: HCYI-10-20.1.2 82.68,81.8 79.4,81.8
  pour Bottom: 71.9,85.9 81.52,85.9 81.69,67.5 88,67.5 88,55 71.9,55
VPV
  Top 1: U1.4 36.77,59.1 36.8,59.13
  Top 2: 35.3,59.2 35.3,58.74 U1.4 38.4,58.9 38.6,58.9
  Top 4: U$1.2 32.37,83.43
  pour Top: 28.7,84.9 28.7,62.8 34.8,56.7 41,56.7 41,84.9

### Text on the board
Top: Jorge Gaviria 1020835081